# Altium schematic sheet Xilinx_main.SchDoc
size A3; Author: Швецов С.В.; Organization: PapuaSoft; SheetNumber: 3; SheetTotal: 8; PageSetup: Record=PageOptions|CenterHorizontal=True|CenterVertical=True|PrintScale=0.71|XCorrection=1.00|YCorrection=1.00|PrintKind=1|BorderSize=5000000|LeftOffset=0|BottomOffset=0|Orientation=2|PaperLength=1000|PaperWidth=1000|Scale=100|PaperSource=15|PrintQuality=600|MediaType=1|DitherType=10|PaperKind=A4|PrintScaleMode=1
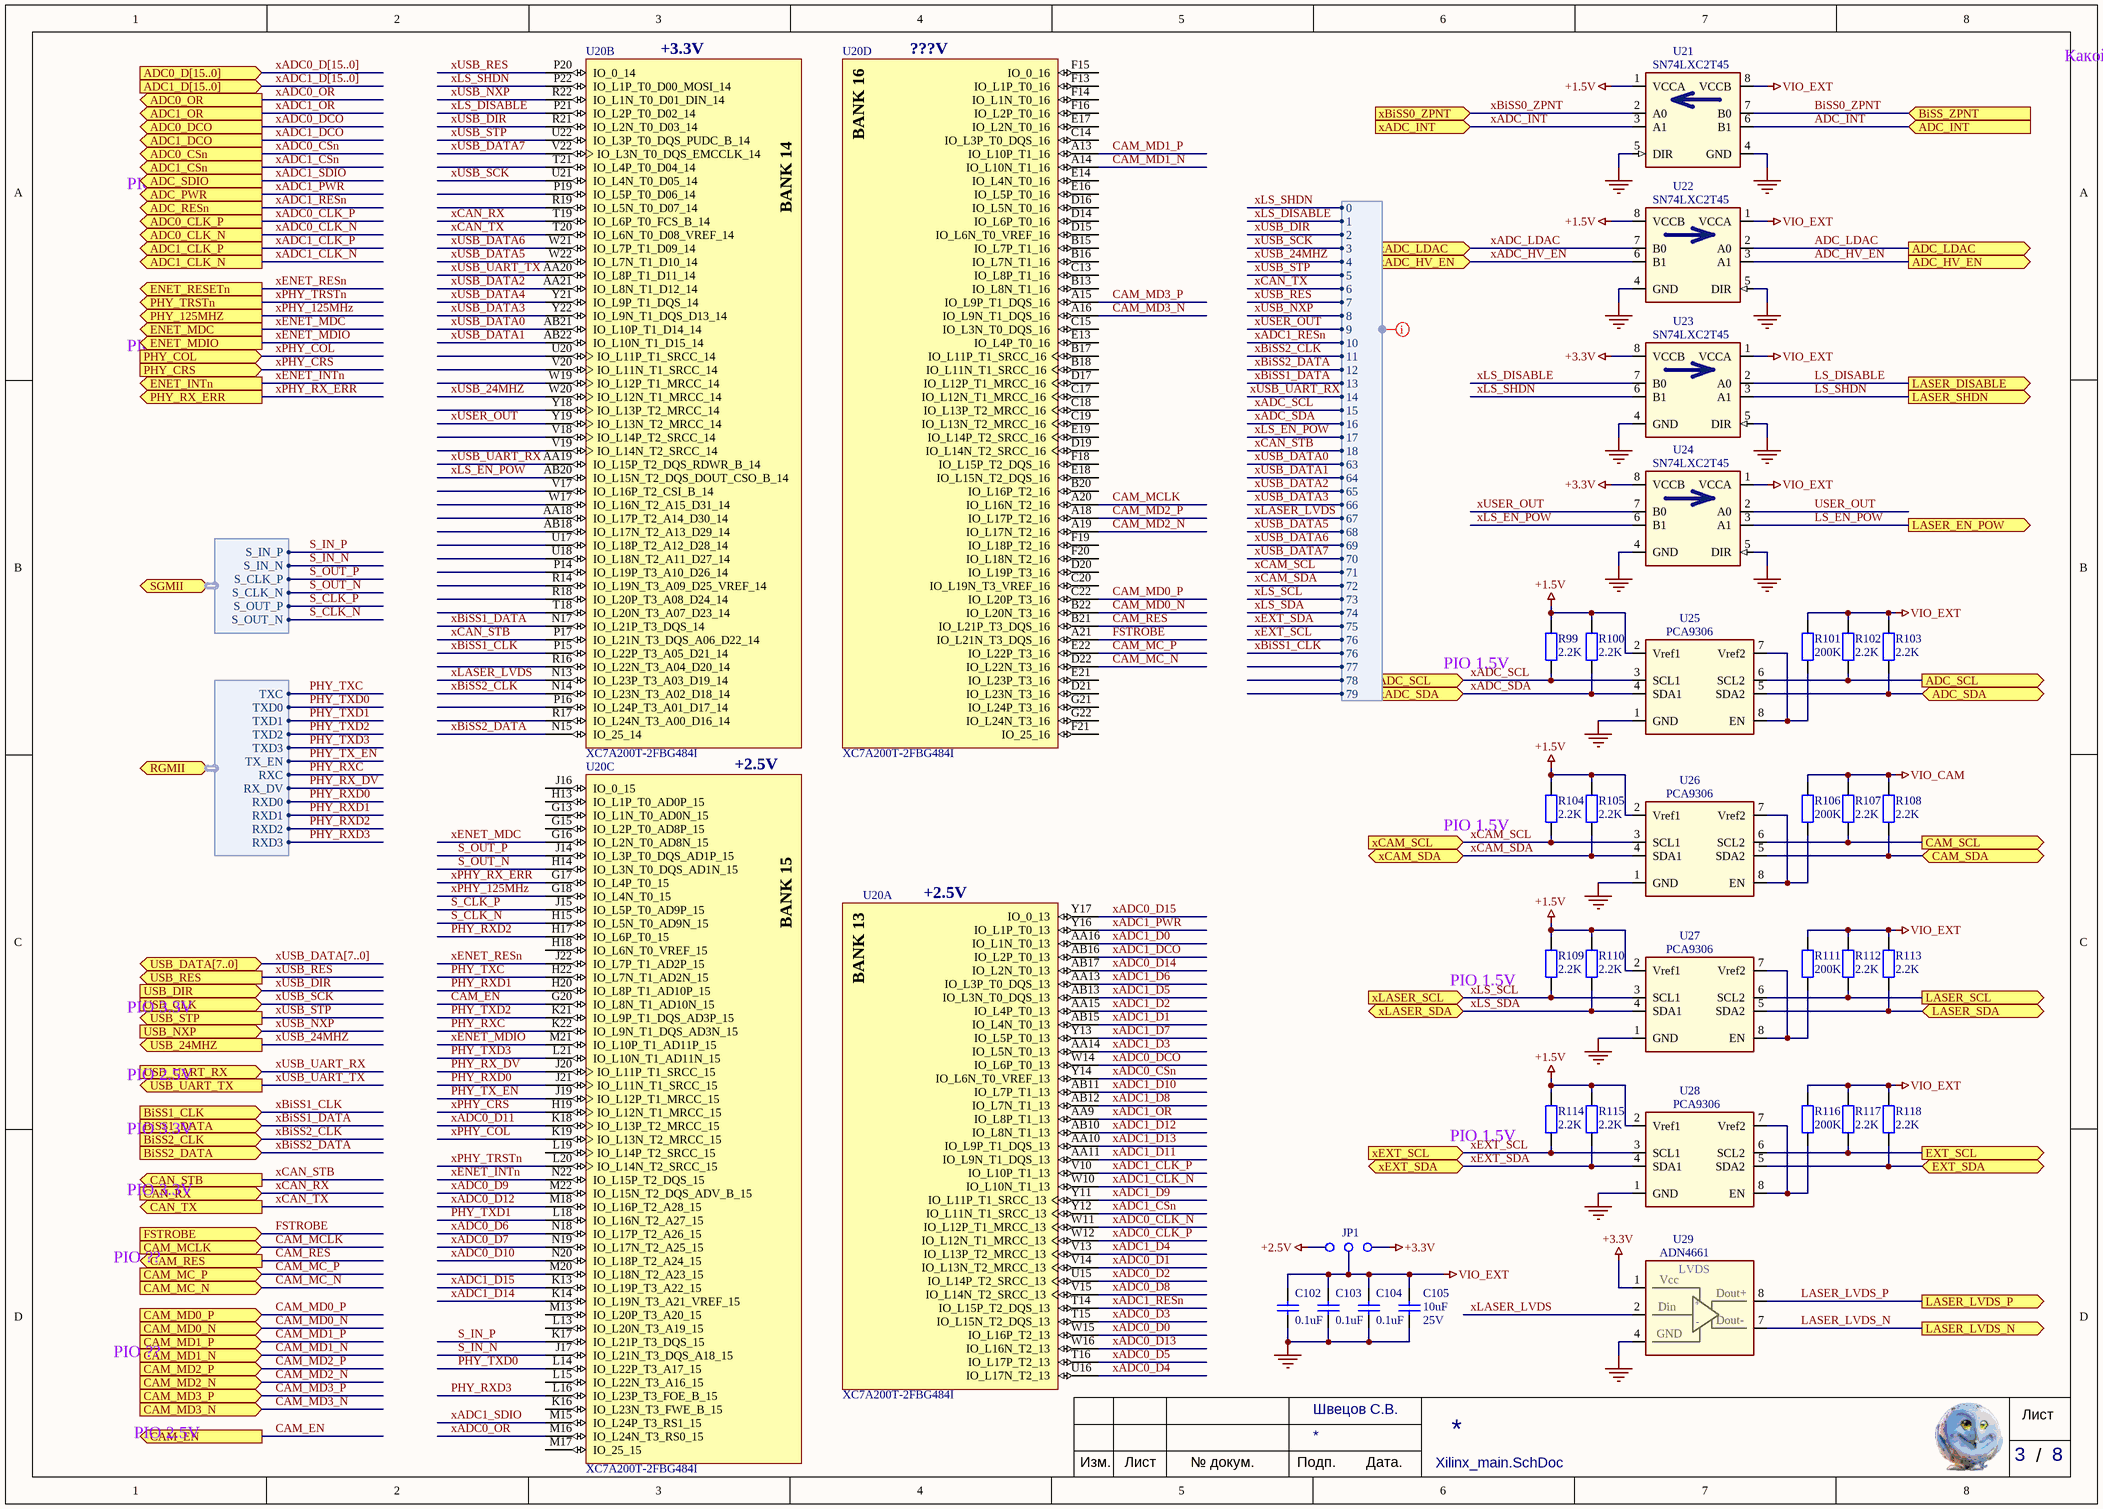
[diagram p0: Xilinx_main.SchDoc]

## Parts
C102  value 0.1uF  [C0402]  (hidden comment: Cap)
C103  value 0.1uF  [C0402]  (hidden comment: Cap)
C104  value 0.1uF  [C0402]  (hidden comment: Cap)
C105  value 10uF  Voltage: 25V  [C0805]  (hidden comment: Cap)
JP1  (no value)  [JUMP-3]  (no BOM)
R99  value 2.2K  [R0402]  (hidden comment: Res2)
R100  value 2.2K  [R0402]  (hidden comment: Res2)
R101  value 200K  [R0402]  (hidden comment: Res2)
R102  value 2.2K  [R0402]  (hidden comment: Res2)
R103  value 2.2K  [R0402]  (hidden comment: Res2)
R104  value 2.2K  [R0402]  (hidden comment: Res2)
R105  value 2.2K  [R0402]  (hidden comment: Res2)
R106  value 200K  [R0402]  (hidden comment: Res2)
R107  value 2.2K  [R0402]  (hidden comment: Res2)
R108  value 2.2K  [R0402]  (hidden comment: Res2)
R109  value 2.2K  [R0402]  (hidden comment: Res2)
R110  value 2.2K  [R0402]  (hidden comment: Res2)
R111  value 200K  [R0402]  (hidden comment: Res2)
R112  value 2.2K  [R0402]  (hidden comment: Res2)
R113  value 2.2K  [R0402]  (hidden comment: Res2)
R114  value 2.2K  [R0402]  (hidden comment: Res2)
R115  value 2.2K  [R0402]  (hidden comment: Res2)
R116  value 200K  [R0402]  (hidden comment: Res2)
R117  value 2.2K  [R0402]  (hidden comment: Res2)
R118  value 2.2K  [R0402]  (hidden comment: Res2)
U20  XC7A200T-2FBG484I  BANK_PWR: +2.5V  [FBG484]  (parts A,B,C,D of 11)
U21  SN74LXC2T45  [SOP50P310X90-8N]
U22  SN74LXC2T45  [SOP50P310X90-8N]
U23  SN74LXC2T45  [SOP50P310X90-8N]
U24  SN74LXC2T45  [SOP50P310X90-8N]
U25  PCA9306  [7WBD3306AMUTCG]
U26  PCA9306  [7WBD3306AMUTCG]
U27  PCA9306  [7WBD3306AMUTCG]
U28  PCA9306  [7WBD3306AMUTCG]
U29  ADN4661  [SO8]

## Ports
ADC0_CLK_N (out), ADC0_CLK_P (out), ADC0_CSn (out), ADC0_D[15..0] (in), ADC0_DCO (out), ADC0_OR (out), ADC1_CLK_N (out), ADC1_CLK_P (out), ADC1_CSn (out), ADC1_D[15..0] (in), ADC1_DCO (out), ADC1_OR (out), ADC_HV_EN (out), ADC_INT (in), ADC_LDAC (out), ADC_PWR (out), ADC_RESn (out), ADC_SCL (out), ADC_SDA (bidir), ADC_SDIO (out), BiSS1_CLK (in), BiSS1_DATA (in), BiSS2_CLK (in), BiSS2_DATA (in), BiSS_ZPNT (in), CAM_EN (out), CAM_MC_N (in), CAM_MC_P (in), CAM_MCLK (in), CAM_MD0_N (in), CAM_MD0_P (in), CAM_MD1_N (in), CAM_MD1_P (in), CAM_MD2_N (in), CAM_MD2_P (in), CAM_MD3_N (in), CAM_MD3_P (in), CAM_RES (out), CAM_SCL (out), CAM_SDA (bidir), CAN_RX (in), CAN_STB (out), CAN_TX (out), ENET_INTn (out), ENET_MDC (out), ENET_MDIO (out), ENET_RESETn (out), EXT_SCL (out), EXT_SDA (bidir), FSTROBE (in), LASER_DISABLE (out), LASER_EN_POW (out), LASER_LVDS_N (out), LASER_LVDS_P (out), LASER_SCL (out), LASER_SDA (bidir), LASER_SHDN (out), PHY_125MHZ (out), PHY_COL (in), PHY_CRS (in), PHY_RX_ERR (out), PHY_TRSTn (out), RGMII (bidir, harness RGMII), SGMII (bidir, harness SGMII), USB_24MHZ (out), USB_CLK (in), USB_DATA[7..0] (bidir), USB_DIR (in), USB_NXP (in), USB_RES (out), USB_STP (out), USB_UART_RX (in), USB_UART_TX (out), xADC_HV_EN (in), xADC_INT (in), xADC_LDAC (in), xADC_SCL (in), xADC_SDA (bidir), xBiSS0_ZPNT (in), xCAM_SCL (in), xCAM_SDA (bidir), xEXT_SCL (in), xEXT_SDA (bidir), xLASER_SCL (in), xLASER_SDA (bidir)

## Harnesses
PLIS_OTHER: 0, 1, 2, 3, 4, 5, 6, 7, 8, 9, 10, 12, 13, 14, 11, 15, 16, 17, 18, 63, 64, 65, 66, 67, 68, 69, 70, 71, 72, 73, 74, 75, 76, 76, 77, 78, 79
SGMII: S_IN_P, S_IN_N, S_CLK_P, S_CLK_N, S_OUT_P, S_OUT_N
RGMII: TXC, TXD0, TXD1, TXD2, TXD3, TX_EN, RXC, RX_DV, RXD0, RXD1, RXD2, RXD3

## Nets
+1.5V: R99.2 R100.2 R104.2 R105.2 R109.2 R110.2 R114.2 R115.2 U21.1(VCCA) U22.8(VCCB) U25.2(Vref1) U26.2(Vref1) U27.2(Vref1) U28.2(Vref1)
+2.5V: JP1.1
+3.3V: JP1.3 U23.8(VCCB) U24.8(VCCB) U29.1(Vss)
GND: C102.2 C103.2 C104.2 C105.2 U21.4(GND) U21.5(DIR) U22.4(GND) U22.5(DIR) U23.4(GND) U23.5(DIR) U24.4(GND) U24.5(DIR) U25.1(GND) U26.1(GND) U27.1(GND) U28.1(GND) U29.4(GND)
VIO_CAM: R106.2 R107.2 R108.2
VIO_EXT: C102.1 C103.1 C104.1 C105.1 JP1.2 R101.2 R102.2 R103.2 R111.2 R112.2 R113.2 R116.2 R117.2 R118.2 U21.8(VCCB) U22.1(VCCA) U23.1(VCCA) U24.1(VCCA)
ADC_HV_EN: U22.3(A1) ; port ADC_HV_EN
ADC_INT: U21.6(B1) ; port ADC_INT
ADC_LDAC: U22.2(A0) ; port ADC_LDAC
ADC_SCL: R102.1 U25.6(SCL2) ; port ADC_SCL
ADC_SDA: R103.1 U25.5(SDA2) ; port ADC_SDA
BiSS0_ZPNT: U21.7(B0) ; port BiSS_ZPNT
CAM_EN: U20.G20(IO_L8N_T1_AD10N_15) ; port CAM_EN
CAM_MC_N: U20.D22(IO_L22N_T3_16) ; port CAM_MC_N
CAM_MC_P: U20.E22(IO_L22P_T3_16) ; port CAM_MC_P
CAM_MCLK: U20.A20(IO_L16N_T2_16) ; port CAM_MCLK
CAM_MD0_N: U20.B22(IO_L20N_T3_16) ; port CAM_MD0_N
CAM_MD0_P: U20.C22(IO_L20P_T3_16) ; port CAM_MD0_P
CAM_MD1_N: U20.A14(IO_L10N_T1_16) ; port CAM_MD1_N
CAM_MD1_P: U20.A13(IO_L10P_T1_16) ; port CAM_MD1_P
CAM_MD2_N: U20.A19(IO_L17N_T2_16) ; port CAM_MD2_N
CAM_MD2_P: U20.A18(IO_L17P_T2_16) ; port CAM_MD2_P
CAM_MD3_N: U20.A16(IO_L9N_T1_DQS_16) ; port CAM_MD3_N
CAM_MD3_P: U20.A15(IO_L9P_T1_DQS_16) ; port CAM_MD3_P
CAM_RES: U20.B21(IO_L21P_T3_DQS_16) ; port CAM_RES
CAM_SCL: R107.1 U26.6(SCL2) ; port CAM_SCL
CAM_SDA: R108.1 U26.5(SDA2) ; port CAM_SDA
EXT_SCL: R117.1 U28.6(SCL2) ; port EXT_SCL
EXT_SDA: R118.1 U28.5(SDA2) ; port EXT_SDA
FSTROBE: U20.A21(IO_L21N_T3_DQS_16) ; port FSTROBE
LASER_LVDS_N: U29.7(OUT0-) ; port LASER_LVDS_N
LASER_LVDS_P: U29.8(OUT0+) ; port LASER_LVDS_P
LASER_SCL: R112.1 U27.6(SCL2) ; port LASER_SCL
LASER_SDA: R113.1 U27.5(SDA2) ; port LASER_SDA
LS_DISABLE: U23.2(A0) ; port LASER_DISABLE
LS_EN_POW: U24.3(A1) ; port LASER_EN_POW
LS_SHDN: U23.3(A1) ; port LASER_SHDN
PHY_RX_DV: U20.J20(IO_L11P_T1_SRCC_15) ; port RGMII.RX_DV
PHY_RXC: U20.K22(IO_L9N_T1_DQS_AD3N_15) ; port RGMII.RXC
PHY_RXD0: U20.J21(IO_L11N_T1_SRCC_15) ; port RGMII.RXD0
PHY_RXD1: U20.H20(IO_L8P_T1_AD10P_15) ; port RGMII.RXD1
PHY_RXD2: U20.H17(IO_L6P_T0_15) ; port RGMII.RXD2
PHY_RXD3: U20.L16(IO_L23P_T3_FOE_B_15) ; port RGMII.RXD3
PHY_TX_EN: U20.J19(IO_L12P_T1_MRCC_15) ; port RGMII.TX_EN
PHY_TXC: U20.H22(IO_L7N_T1_AD2N_15) ; port RGMII.TXC
PHY_TXD0: U20.L14(IO_L22P_T3_A17_15) ; port RGMII.TXD0
PHY_TXD1: U20.L18(IO_L16N_T2_A27_15) ; port RGMII.TXD1
PHY_TXD2: U20.K21(IO_L9P_T1_DQS_AD3P_15) ; port RGMII.TXD2
PHY_TXD3: U20.L21(IO_L10N_T1_AD11N_15) ; port RGMII.TXD3
S_CLK_N: U20.H15(IO_L5N_T0_AD9N_15) ; port SGMII.S_OUT_N
S_CLK_P: U20.J15(IO_L5P_T0_AD9P_15) ; port SGMII.S_OUT_P
S_IN_N: U20.J17(IO_L21N_T3_DQS_A18_15) ; port SGMII.S_IN_N
S_IN_P: U20.K17(IO_L21P_T3_DQS_15) ; port SGMII.S_IN_P
S_OUT_N: U20.H14(IO_L3N_T0_DQS_AD1N_15) ; port SGMII.S_CLK_N
S_OUT_P: U20.J14(IO_L3P_T0_DQS_AD1P_15) ; port SGMII.S_CLK_P
USER_OUT: U24.2(A0)
xADC0_CLK_N: U20.W11(IO_L12P_T1_MRCC_13) ; port ADC0_CLK_N
xADC0_CLK_P: U20.W12(IO_L12N_T1_MRCC_13) ; port ADC0_CLK_P
xADC0_CSn: U20.Y14(IO_L6N_T0_VREF_13) ; port ADC0_CSn
xADC0_D0: U20.W15(IO_L16P_T2_13)
xADC0_D1: U20.V14(IO_L13N_T2_MRCC_13)
xADC0_D2: U20.U15(IO_L14P_T2_SRCC_13)
xADC0_D3: U20.T15(IO_L15N_T2_DQS_13)
xADC0_D4: U20.U16(IO_L17N_T2_13)
xADC0_D5: U20.T16(IO_L17P_T2_13)
xADC0_D6: U20.N18(IO_L17P_T2_A26_15)
xADC0_D7: U20.N19(IO_L17N_T2_A25_15)
xADC0_D8: U20.V15(IO_L14N_T2_SRCC_13)
xADC0_D9: U20.M22(IO_L15N_T2_DQS_ADV_B_15)
xADC0_D10: U20.N20(IO_L18P_T2_A24_15)
xADC0_D11: U20.K18(IO_L13P_T2_MRCC_15)
xADC0_D12: U20.M18(IO_L16P_T2_A28_15)
xADC0_D13: U20.W16(IO_L16N_T2_13)
xADC0_D14: U20.AB17(IO_L2N_T0_13)
xADC0_D15: U20.Y17(IO_0_13)
xADC0_DCO: U20.W14(IO_L6P_T0_13) ; port ADC0_DCO
xADC0_OR: U20.M16(IO_L24N_T3_RS0_15) ; port ADC0_OR
xADC1_CLK_N: U20.W10(IO_L10N_T1_13) ; port ADC1_CLK_N
xADC1_CLK_P: U20.V10(IO_L10P_T1_13) ; port ADC1_CLK_P
xADC1_CSn: U20.Y12(IO_L11N_T1_SRCC_13) ; port ADC1_CSn
xADC1_D0: U20.AA16(IO_L1N_T0_13)
xADC1_D1: U20.AB15(IO_L4N_T0_13)
xADC1_D2: U20.AA15(IO_L4P_T0_13)
xADC1_D3: U20.AA14(IO_L5N_T0_13)
xADC1_D4: U20.V13(IO_L13P_T2_MRCC_13)
xADC1_D5: U20.AB13(IO_L3N_T0_DQS_13)
xADC1_D6: U20.AA13(IO_L3P_T0_DQS_13)
xADC1_D7: U20.Y13(IO_L5P_T0_13)
xADC1_D8: U20.AB12(IO_L7N_T1_13)
xADC1_D9: U20.Y11(IO_L11P_T1_SRCC_13)
xADC1_D10: U20.AB11(IO_L7P_T1_13)
xADC1_D11: U20.AA11(IO_L9N_T1_DQS_13)
xADC1_D12: U20.AB10(IO_L8N_T1_13)
xADC1_D13: U20.AA10(IO_L9P_T1_DQS_13)
xADC1_D14: U20.K14(IO_L19N_T3_A21_VREF_15)
xADC1_D15: U20.K13(IO_L19P_T3_A22_15)
xADC1_DCO: U20.AB16(IO_L2P_T0_13) ; port ADC1_DCO
xADC1_OR: U20.AA9(IO_L8P_T1_13) ; port ADC1_OR
xADC1_PWR: U20.Y16(IO_L1P_T0_13) ; port ADC_PWR
xADC1_RESn: U20.T14(IO_L15P_T2_DQS_13) ; port ADC_RESn, harness PLIS_OTHER.10
xADC1_SDIO: U20.M15(IO_L24P_T3_RS1_15) ; port ADC_SDIO
xADC_HV_EN: U22.6(B1) ; port xADC_HV_EN
xADC_INT: U21.3(A1) ; port xADC_INT
xADC_LDAC: U22.7(B0) ; port xADC_LDAC
xADC_SCL: R99.1 U25.3(SCL1) ; port xADC_SCL, harness PLIS_OTHER.15
xADC_SDA: R100.1 U25.4(SDA1) ; port xADC_SDA, harness PLIS_OTHER.16
xBiSS0_ZPNT: U21.2(A0) ; port xBiSS0_ZPNT
xBiSS1_CLK: R114.1 U20.P15(IO_L22P_T3_A05_D21_14) U28.3(SCL1) ; port BiSS1_CLK, port xEXT_SCL, harness PLIS_OTHER.76  [also labelled xEXT_SCL]
xBiSS1_DATA: U20.N17(IO_L21P_T3_DQS_14) ; port BiSS1_DATA, harness PLIS_OTHER.13
xBiSS2_CLK: U20.N14(IO_L23N_T3_A02_D18_14) ; port BiSS2_CLK, harness PLIS_OTHER.11
xBiSS2_DATA: U20.N15(IO_25_14) ; port BiSS2_DATA, harness PLIS_OTHER.12
xCAM_SCL: R104.1 U26.3(SCL1) ; port xCAM_SCL, harness PLIS_OTHER.71
xCAM_SDA: R105.1 U26.4(SDA1) ; port xCAM_SDA, harness PLIS_OTHER.72
xCAN_RX: U20.T19(IO_L6P_T0_FCS_B_14) ; port CAN_RX
xCAN_STB: U20.P17(IO_L21N_T3_DQS_A06_D22_14) ; port CAN_STB, harness PLIS_OTHER.18
xCAN_TX: U20.T20(IO_L6N_T0_D08_VREF_14) ; port CAN_TX, harness PLIS_OTHER.6
xENET_INTn: U20.N22(IO_L15P_T2_DQS_15) ; port ENET_INTn
xENET_MDC: U20.G16(IO_L2N_T0_AD8N_15) ; port ENET_MDC
xENET_MDIO: U20.M21(IO_L10P_T1_AD11P_15) ; port ENET_MDIO
xENET_RESn: U20.J22(IO_L7P_T1_AD2P_15) ; port ENET_RESETn
xEXT_SDA: R115.1 U28.4(SDA1) ; port xEXT_SDA, harness PLIS_OTHER.75
xLASER_LVDS: U20.N13(IO_L23P_T3_A03_D19_14) U29.2(Din+) ; harness PLIS_OTHER.67
xLS_DISABLE: U20.P21(IO_L2P_T0_D02_14) U23.7(B0) ; harness PLIS_OTHER.1
xLS_EN_POW: U20.AB20(IO_L15N_T2_DQS_DOUT_CSO_B_14) U24.6(B1) ; harness PLIS_OTHER.17
xLS_SCL: R109.1 U27.3(SCL1) ; port xLASER_SCL, harness PLIS_OTHER.73
xLS_SDA: R110.1 U27.4(SDA1) ; port xLASER_SDA, harness PLIS_OTHER.74
xLS_SHDN: U20.P22(IO_L1P_T0_D00_MOSI_14) U23.6(B1) ; harness PLIS_OTHER.0
xPHY_125MHz: U20.G18(IO_L4N_T0_15) ; port PHY_125MHZ
xPHY_COL: U20.K19(IO_L13N_T2_MRCC_15) ; port PHY_COL
xPHY_CRS: U20.H19(IO_L12N_T1_MRCC_15) ; port PHY_CRS
xPHY_RX_ERR: U20.G17(IO_L4P_T0_15) ; port PHY_RX_ERR
xPHY_TRSTn: U20.L20(IO_L14N_T2_SRCC_15) ; port PHY_TRSTn
xUSB_24MHZ: U20.W20(IO_L12N_T1_MRCC_14) ; port USB_24MHZ, harness PLIS_OTHER.4
xUSB_DATA0: U20.AB21(IO_L10P_T1_D14_14) ; harness PLIS_OTHER.63
xUSB_DATA1: U20.AB22(IO_L10N_T1_D15_14) ; harness PLIS_OTHER.64
xUSB_DATA2: U20.AA21(IO_L8N_T1_D12_14) ; harness PLIS_OTHER.65
xUSB_DATA3: U20.Y22(IO_L9N_T1_DQS_D13_14) ; harness PLIS_OTHER.66
xUSB_DATA4: U20.Y21(IO_L9P_T1_DQS_14)
xUSB_DATA5: U20.W22(IO_L7N_T1_D10_14) ; harness PLIS_OTHER.68
xUSB_DATA6: U20.W21(IO_L7P_T1_D09_14) ; harness PLIS_OTHER.69
xUSB_DATA7: U20.V22(IO_L3N_T0_DQS_EMCCLK_14) ; harness PLIS_OTHER.70
xUSB_DIR: U20.R21(IO_L2N_T0_D03_14) ; port USB_DIR, harness PLIS_OTHER.2
xUSB_NXP: U20.R22(IO_L1N_T0_D01_DIN_14) ; port USB_NXP, harness PLIS_OTHER.8
xUSB_RES: U20.P20(IO_0_14) ; port USB_RES, harness PLIS_OTHER.7
xUSB_SCK: U20.U21(IO_L4N_T0_D05_14) ; port USB_CLK, harness PLIS_OTHER.3
xUSB_STP: U20.U22(IO_L3P_T0_DQS_PUDC_B_14) ; port USB_STP, harness PLIS_OTHER.5
xUSB_UART_RX: U20.AA19(IO_L15P_T2_DQS_RDWR_B_14) ; port USB_UART_RX, harness PLIS_OTHER.14
xUSB_UART_TX: U20.AA20(IO_L8P_T1_D11_14) ; port USB_UART_TX
xUSER_OUT: U20.Y19(IO_L13N_T2_MRCC_14) U24.7(B0) ; harness PLIS_OTHER.9
NetR101_1: R101.1 U25.7(Vref2) U25.8(EN)
NetR106_1: R106.1 U26.7(Vref2) U26.8(EN)
NetR111_1: R111.1 U27.7(Vref2) U27.8(EN)
NetR116_1: R116.1 U28.7(Vref2) U28.8(EN)

Not connected (* = marked no-connect by the designer): U20 AA18(IO_L17P_T2_A14_D30_14) AB18(IO_L17N_T2_A13_D29_14) B13(IO_L8N_T1_16) B15(IO_L7P_T1_16) B16(IO_L7N_T1_16) B17(IO_L11P_T1_SRCC_16) B18(IO_L11N_T1_SRCC_16) B20(IO_L16P_T2_16) C13(IO_L8P_T1_16) C14(IO_L3P_T0_DQS_16) C15(IO_L3N_T0_DQS_16) C17(IO_L12N_T1_MRCC_16) C18(IO_L13P_T2_MRCC_16) C19(IO_L13N_T2_MRCC_16) C20(IO_L19N_T3_VREF_16) D14(IO_L6P_T0_16) D15(IO_L6N_T0_VREF_16) D16(IO_L5N_T0_16) D17(IO_L12P_T1_MRCC_16) D19(IO_L14N_T2_SRCC_16) D20(IO_L19P_T3_16) D21(IO_L23N_T3_16) E13(IO_L4P_T0_16) E14(IO_L4N_T0_16) E16(IO_L5P_T0_16) E17(IO_L2N_T0_16) E18(IO_L15N_T2_DQS_16) E19(IO_L14P_T2_SRCC_16) E21(IO_L23P_T3_16) F13(IO_L1P_T0_16) F14(IO_L1N_T0_16) F15(IO_0_16) F16(IO_L2P_T0_16) F18(IO_L15P_T2_DQS_16) F19(IO_L18P_T2_16) F20(IO_L18N_T2_16) F21(IO_25_16) G13(IO_L1N_T0_AD0N_15) G15(IO_L2P_T0_AD8P_15) G21(IO_L24P_T3_16) G22(IO_L24N_T3_16) H13(IO_L1P_T0_AD0P_15) H18(IO_L6N_T0_VREF_15) J16(IO_0_15) K16(IO_L23N_T3_FWE_B_15) L13(IO_L20N_T3_A19_15) L15(IO_L22N_T3_A16_15) L19(IO_L14P_T2_SRCC_15) M13(IO_L20P_T3_A20_15) M17(IO_25_15) M20(IO_L18N_T2_A23_15) P14(IO_L19P_T3_A10_D26_14) P16(IO_L24P_T3_A01_D17_14) P19(IO_L5P_T0_D06_14) R14(IO_L19N_T3_A09_D25_VREF_14) R16(IO_L22N_T3_A04_D20_14) R17(IO_L24N_T3_A00_D16_14) R18(IO_L20P_T3_A08_D24_14) R19(IO_L5N_T0_D07_14) T18(IO_L20N_T3_A07_D23_14) T21(IO_L4P_T0_D04_14) U17(IO_L18P_T2_A12_D28_14) U18(IO_L18N_T2_A11_D27_14) U20(IO_L11P_T1_SRCC_14) V17(IO_L16P_T2_CSI_B_14) V18(IO_L14P_T2_SRCC_14) V19(IO_L14N_T2_SRCC_14) V20(IO_L11N_T1_SRCC_14) W17(IO_L16N_T2_A15_D31_14) W19(IO_L12P_T1_MRCC_14) Y18(IO_L13P_T2_MRCC_14); U29 3(NC) 5(NC) 6(NC)

## Buses and harness runs
bus xADC0_D[15..0] = port ADC0_D[15..0]
bus xADC1_D[15..0] = port ADC1_D[15..0]
bus xUSB_DATA[7..0] = port USB_DATA[7..0]

## Layout directives
net class PLIS_OTHER2: (no net found under the mark)

## Notes on the sheet
- Какой уровень интерфейсов
- PIO 2.5V
- PIO 1.5V
- PIO 3.3V
- PIO ??
- Лист
- /
- Изм.
- № докум.
- Подп.
- Дата.
- (in symbol ADN4661) LVDS; Vcc; Dout+; +; Din; -; Dout-
- (in symbol XC7A200T-2FBG484I, part A) BANK 13
- (in symbol XC7A200T-2FBG484I, part B) BANK 14
- (in symbol XC7A200T-2FBG484I, part C) BANK 15
- (in symbol XC7A200T-2FBG484I, part D) BANK 16

## Library data of the parts
C102-C104 = Cap: Конденсатор керамический; Voltage: 10V; PackageReference: 0402; ClassName: Xilinx PWR
C105 = Cap: GRM21BR61E106KA73L; PackageReference: 0805; ClassName: Power1.5
JP1 = SIP3: Печатная перемычка на плате
R99-R118 = Res2: Резистор; PackageReference: 0402; ClassName: LEVEL SHIFTER
U20 = XC7A200T-2FBG484I: Artix-7 FPGA, 285 User I/Os, 4 GTP, 484-Ball BGA; Manufacturer: Xilinx; CLBs (Slices): 33650; DSP48E1 Slices: 740; Block RAM Blocks (36Kb): 365; Logic Cells: 215360; Block RAM Blocks (Max Kb): 13140; Speed Grade: -2; Clock Mgmt Tiles (CMTs): 10; Block RAM Blocks (18Kb): 730; Max User I/O: 500; ComponentLink5Description: Packaging and Pinout; CLBs (Max Distributed RAM Kb): 2888; ComponentLink4Description: Package File; ComponentLink5URL: http://www.xilinx.com/support/documentation/user_guides/ug475_7Series_Pkg_Pinout.pdf; ComponentLink1Description: Datasheet; ComponentLink2Description: Package Specification; DatasheetVersion: v1.12; ComponentLink3URL: http://www.xilinx.com/support/documentation/data_sheets/ds181_Artix_7_Data_Sheet.pdf; ComponentLink1URL: http://www.xilinx.com/support/documentation/data_sheets/ds180_7Series_Overview.pdf; Code_JEDEC: MS-034; ComponentLink2URL: http://www.xilinx.com/support/documentation/user_guides/ug475_7Series_Pkg_Pinout.pdf; ComponentLink3Description: DC and Switching Characteristics; Generic Part Number: XC7A200T; RoHS: Pb-Free; ComponentLink4URL: http://www.xilinx.com/support/packagefiles/a7packages/xc7a200tfbg484pkg.txt; PackageVersion: Rev 1.8; PackageReference: FBG484; PackageDescription: Flip-Chip Lidless BGA, Body 23 x 23 mm, 1.0 mm Pitch; Value: XC7A200T-2FBG484I
U21-U24 = SN74LXC2T45: Преобразователь уровня; PackageReference: VSSOP; Value: SN74LXC2T45
U25-U28 = PCA9306: Преобразователь уровня I2C; PackageReference: QFN-10; Value: PCA9306; ClassName: LEVEL SHIFTER
U29 = ADN4661: LVDS, High Speed Differential Driver; Value: DS90LV047A; PackageReference: SO8; ClassName: LEVEL SHIFTER